# EasyEDA schematic SCH_555-Circuit_2025-03-19.json
TITLE: Sheet_1; REV: 1.0; Date: 2025-03-10; Sheet: 1/1; Drawn By: braxtonios; Company: Your Company
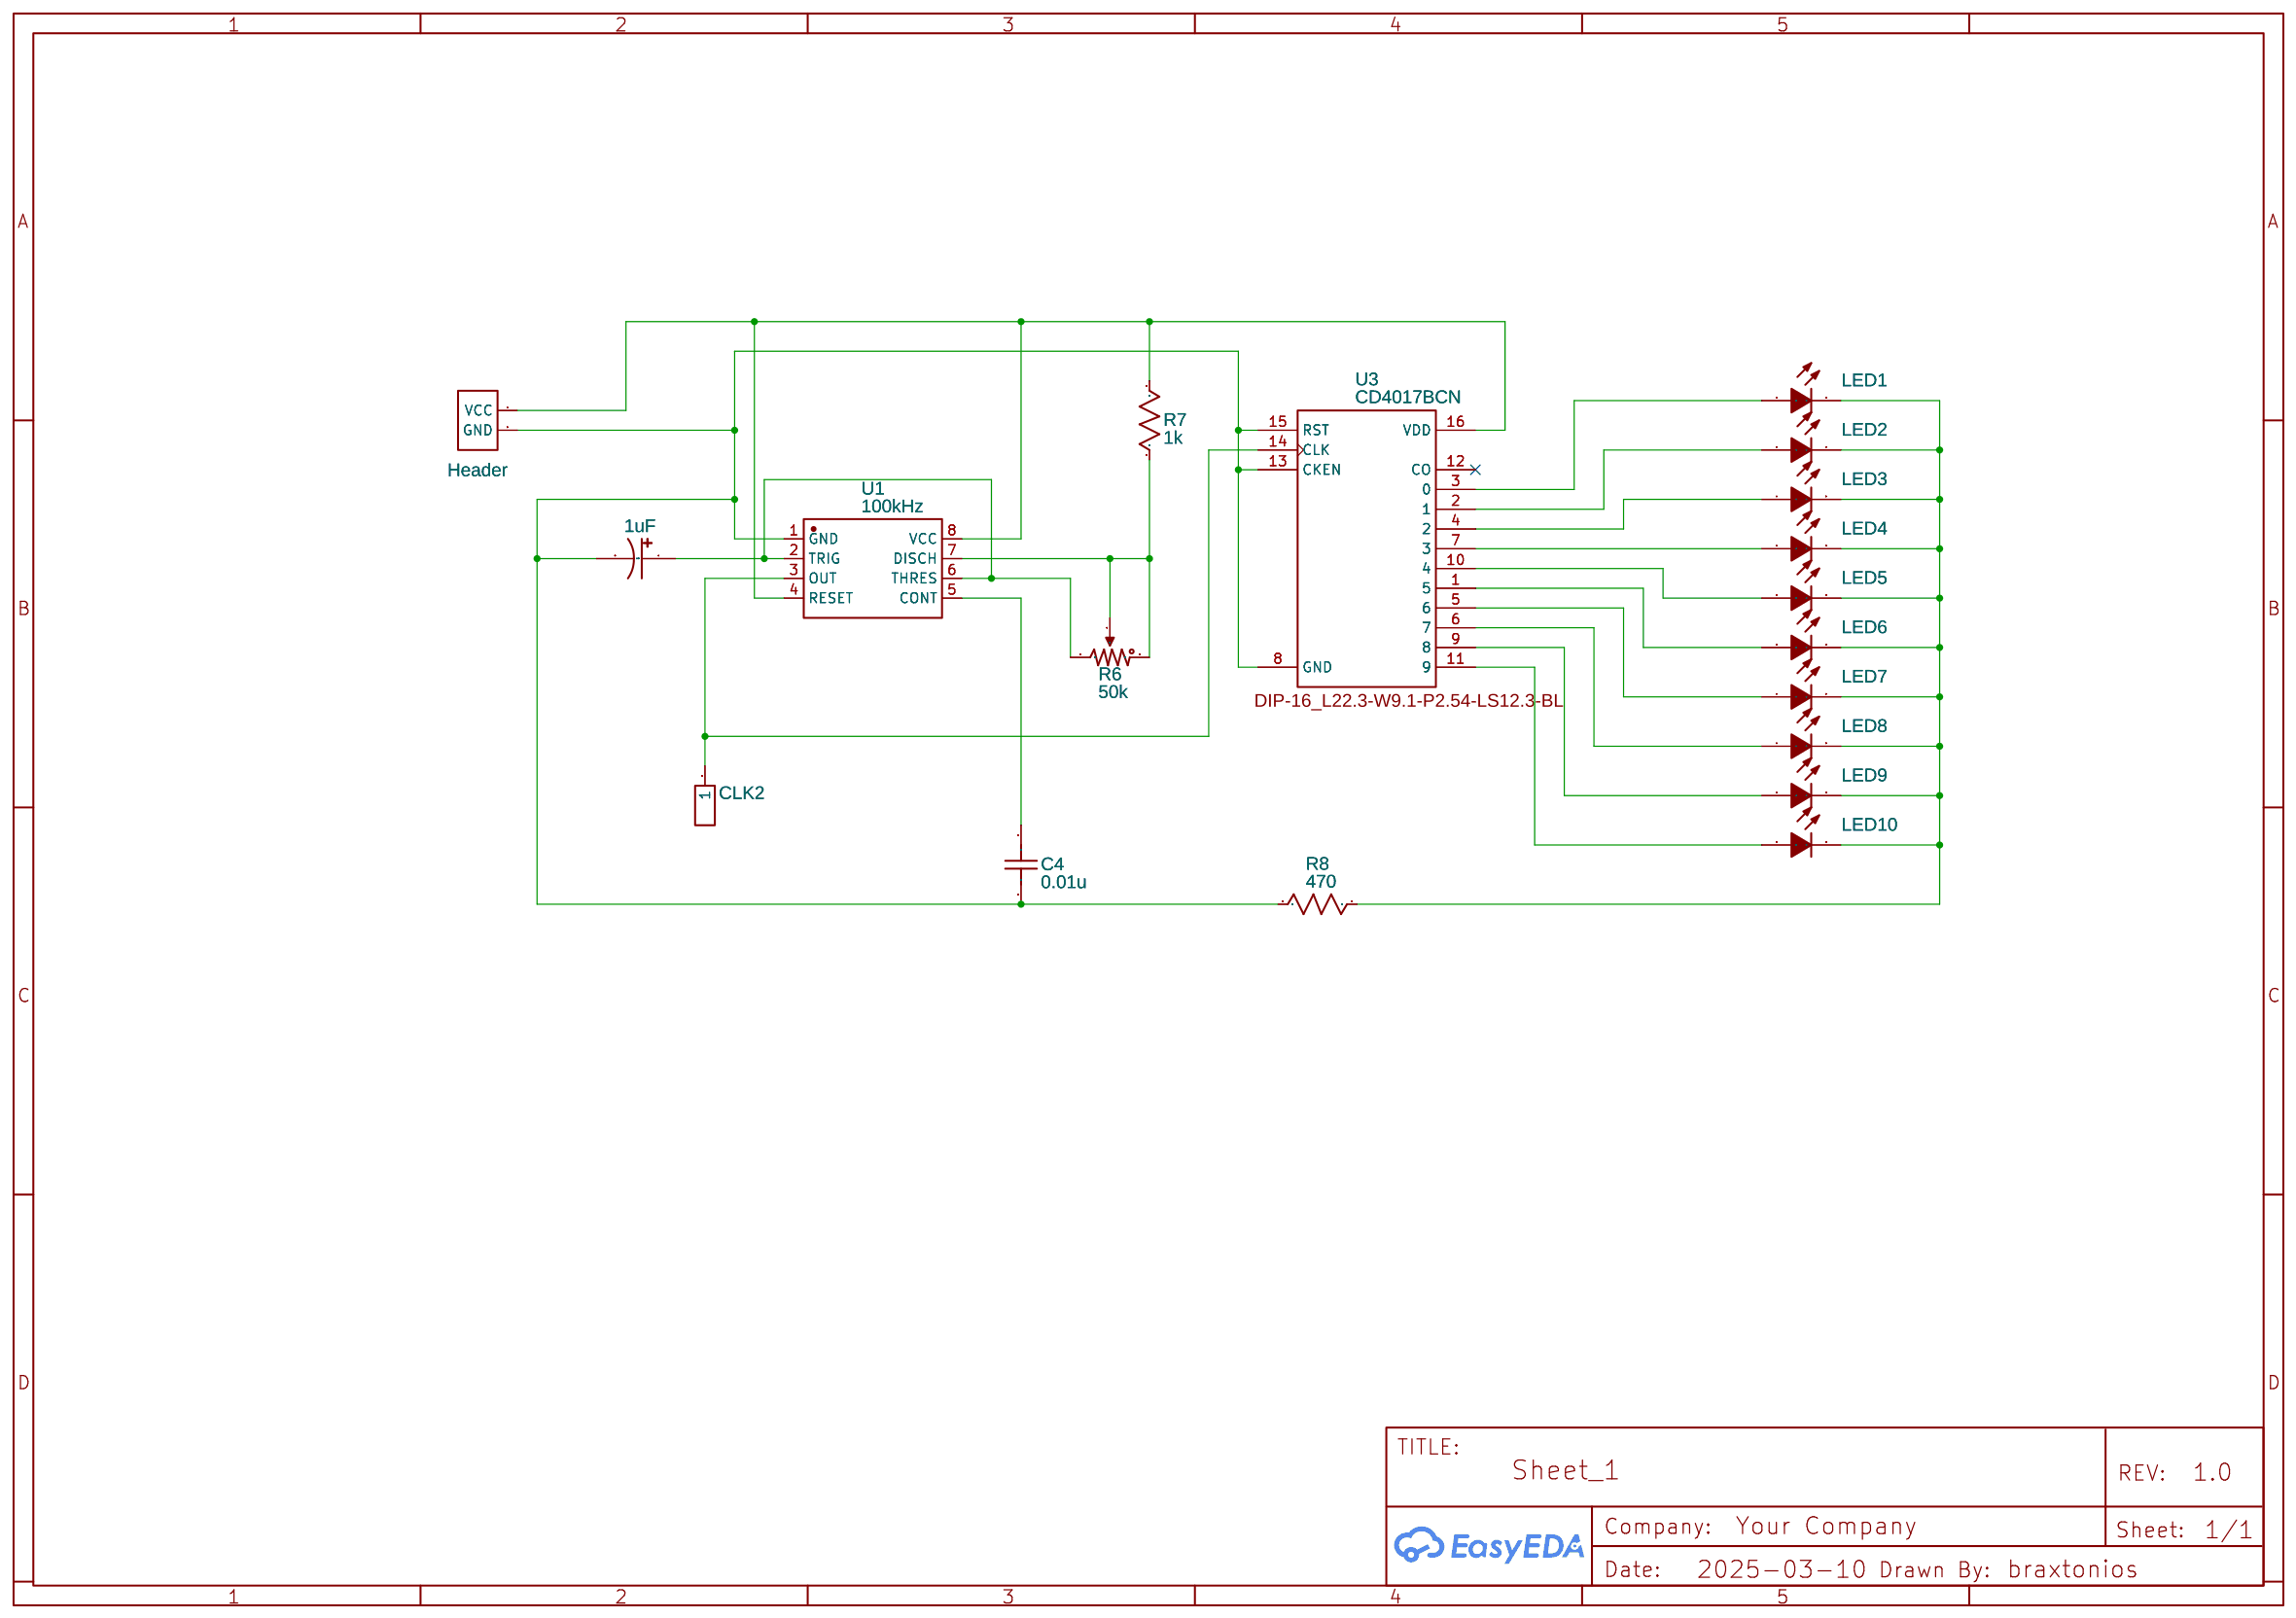
[diagram p0: schematic sheet]

## Parts
C3  1uF  [CAP-TH_BD5.0-P2.00-D0.8-FD]
C4  0.01u  [C0603]
CLK2  C81276  [HDR-TH_1P-P2.54-V-M]
H2  Header  [HDR-M-2.54_1X2]
LED1  LED_5MM  [LED-TH_BD5.0-P2.54-FD_C9900023552]
LED2  LED_5MM  [LED-TH_BD5.0-P2.54-FD_C9900023552]
LED3  LED_5MM  [LED-TH_BD5.0-P2.54-FD_C9900023552]
LED4  LED_5MM  [LED-TH_BD5.0-P2.54-FD_C9900023552]
LED5  LED_5MM  [LED-TH_BD5.0-P2.54-FD_C9900023552]
LED6  LED_5MM  [LED-TH_BD5.0-P2.54-FD_C9900023552]
LED7  LED_5MM  [LED-TH_BD5.0-P2.54-FD_C9900023552]
LED8  LED_5MM  [LED-TH_BD5.0-P2.54-FD_C9900023552]
LED9  LED_5MM  [LED-TH_BD5.0-P2.54-FD_C9900023552]
LED10  LED_5MM  [LED-TH_BD5.0-P2.54-FD_C9900023552]
R6  50k  [RES-ADJ-3296X]
R7  1k  [R_AXIAL-0.3]
R8  470  [R_AXIAL-0.3]
U1  100kHz  [DIP-8_L9.8-W6.6-P2.54-LS7.6-BL]
U3  CD4017BCN  [DIP-16_L22.3-W9.1-P2.54-LS12.3-BL]

## Library data of the parts
C3 = UVZ1H010MDD: Contributor: LCSC; Supplier: LCSC; Supplier Part: C62934; Manufacturer: Nichicon(尼吉康)
C4 = C_0603_US: Supplier Part: C6204607; Supplier: LCSC; Contributor: LCEDA_Lib
CLK2 = Header-Male-2.54_1x1: Supplier: LCSC; Manufacturer Part: 2.54-1*1P针; JLCPCB Part Class: Extended Part; Package Display: No; Manufacturer: BOOMELE(Boom Precision Elec); Contributor: Thejo Prakash
H2 = HEADER-FEMALE-2.54_1X2: Contributor: nonstop2004; Supplier: LCSC; Supplier Part: C492401; Package Display: No
LED1-LED10 = LED_5MM: Contributor: lcsc; Supplier: LCSC; Supplier Part: C2895480
R6 = Potentiometer: K(%): 50; Manufacturer Part: ?; Supplier: LCSC; Supplier Part: C118912; Package Display: No
R7 = Resistor: Manufacturer Part: ?; Supplier Part: C713997; Supplier: LCSC
R8 = Resistor: Manufacturer Part: ?; Supplier Part: C58592; Supplier: LCSC
U1 = NE555P: Supplier: LCSC; Manufacturer: TI(德州仪器); Supplier Part: C46749; JLCPCB Part Class: Extended Part
U3 = CD4017BCN: Decade CounterDivider with 10 Decoded Outputs; Supplier: LCSC; Supplier Part: C32710674; Package Display: Yes

## Nets
Net-(C3-1): C3.1 R6.1 U1.2(TRIG) U1.6(THRES)
Net-(C3-2): C3.2 C4.2 H2.2(GND) R8.2 U1.1(GND) U3.8(GND) U3.13(CKEN) U3.15(RST)
Net-(C4-1): C4.1 U1.5(CONT)
Net-(CLK2-1): CLK2.1 U1.3(OUT) U3.14(CLK)
Net-(H2-1): H2.1(VCC) R7.2 U1.4(RESET) U1.8(VCC) U3.16(VDD)
Net-(LED1-1): LED1.1(A) U3.3(0)
Net-(LED1-2): LED1.2(K) LED2.2(K) LED3.2(K) LED4.2(K) LED5.2(K) LED6.2(K) LED7.2(K) LED8.2(K) LED9.2(K) LED10.2(K) R8.1
Net-(LED2-1): LED2.1(A) U3.2(1)
Net-(LED3-1): LED3.1(A) U3.4(2)
Net-(LED4-1): LED4.1(A) U3.7(3)
Net-(LED5-1): LED5.1(A) U3.10(4)
Net-(LED6-1): LED6.1(A) U3.1(5)
Net-(LED7-1): LED7.1(A) U3.5(6)
Net-(LED8-1): LED8.1(A) U3.6(7)
Net-(LED9-1): LED9.1(A) U3.9(8)
Net-(LED10-1): LED10.1(A) U3.11(9)
Net-(R6-2): R6.2(3) R6.3(2) R7.1 U1.7(DISCH)

Not connected (* = marked no-connect by the designer): U3 12(CO)*
